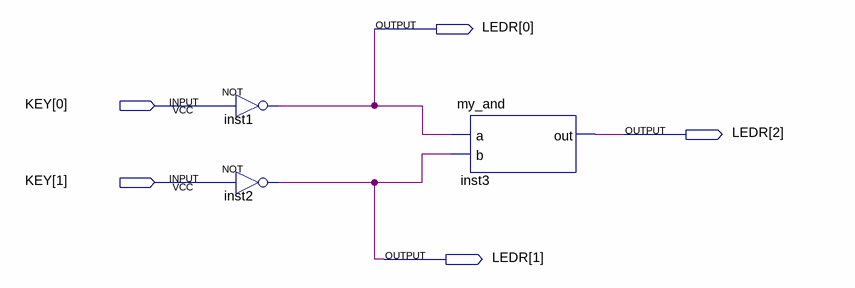
[diagram p0: schematic sheet]
// Quartus schematic project.bdf as structural Verilog: 3 symbols, 5 pins
module project (
  input  [1:0] KEY,
  output [2:0] LEDR
);

  not inst1 (LEDR[0], KEY[0]);
  not inst2 (LEDR[1], KEY[1]);
  my_and inst3 (.a(LEDR[0]), .b(LEDR[1]), .out(LEDR[2]));
endmodule
